# Altium project RC_CAR.PrjPCB
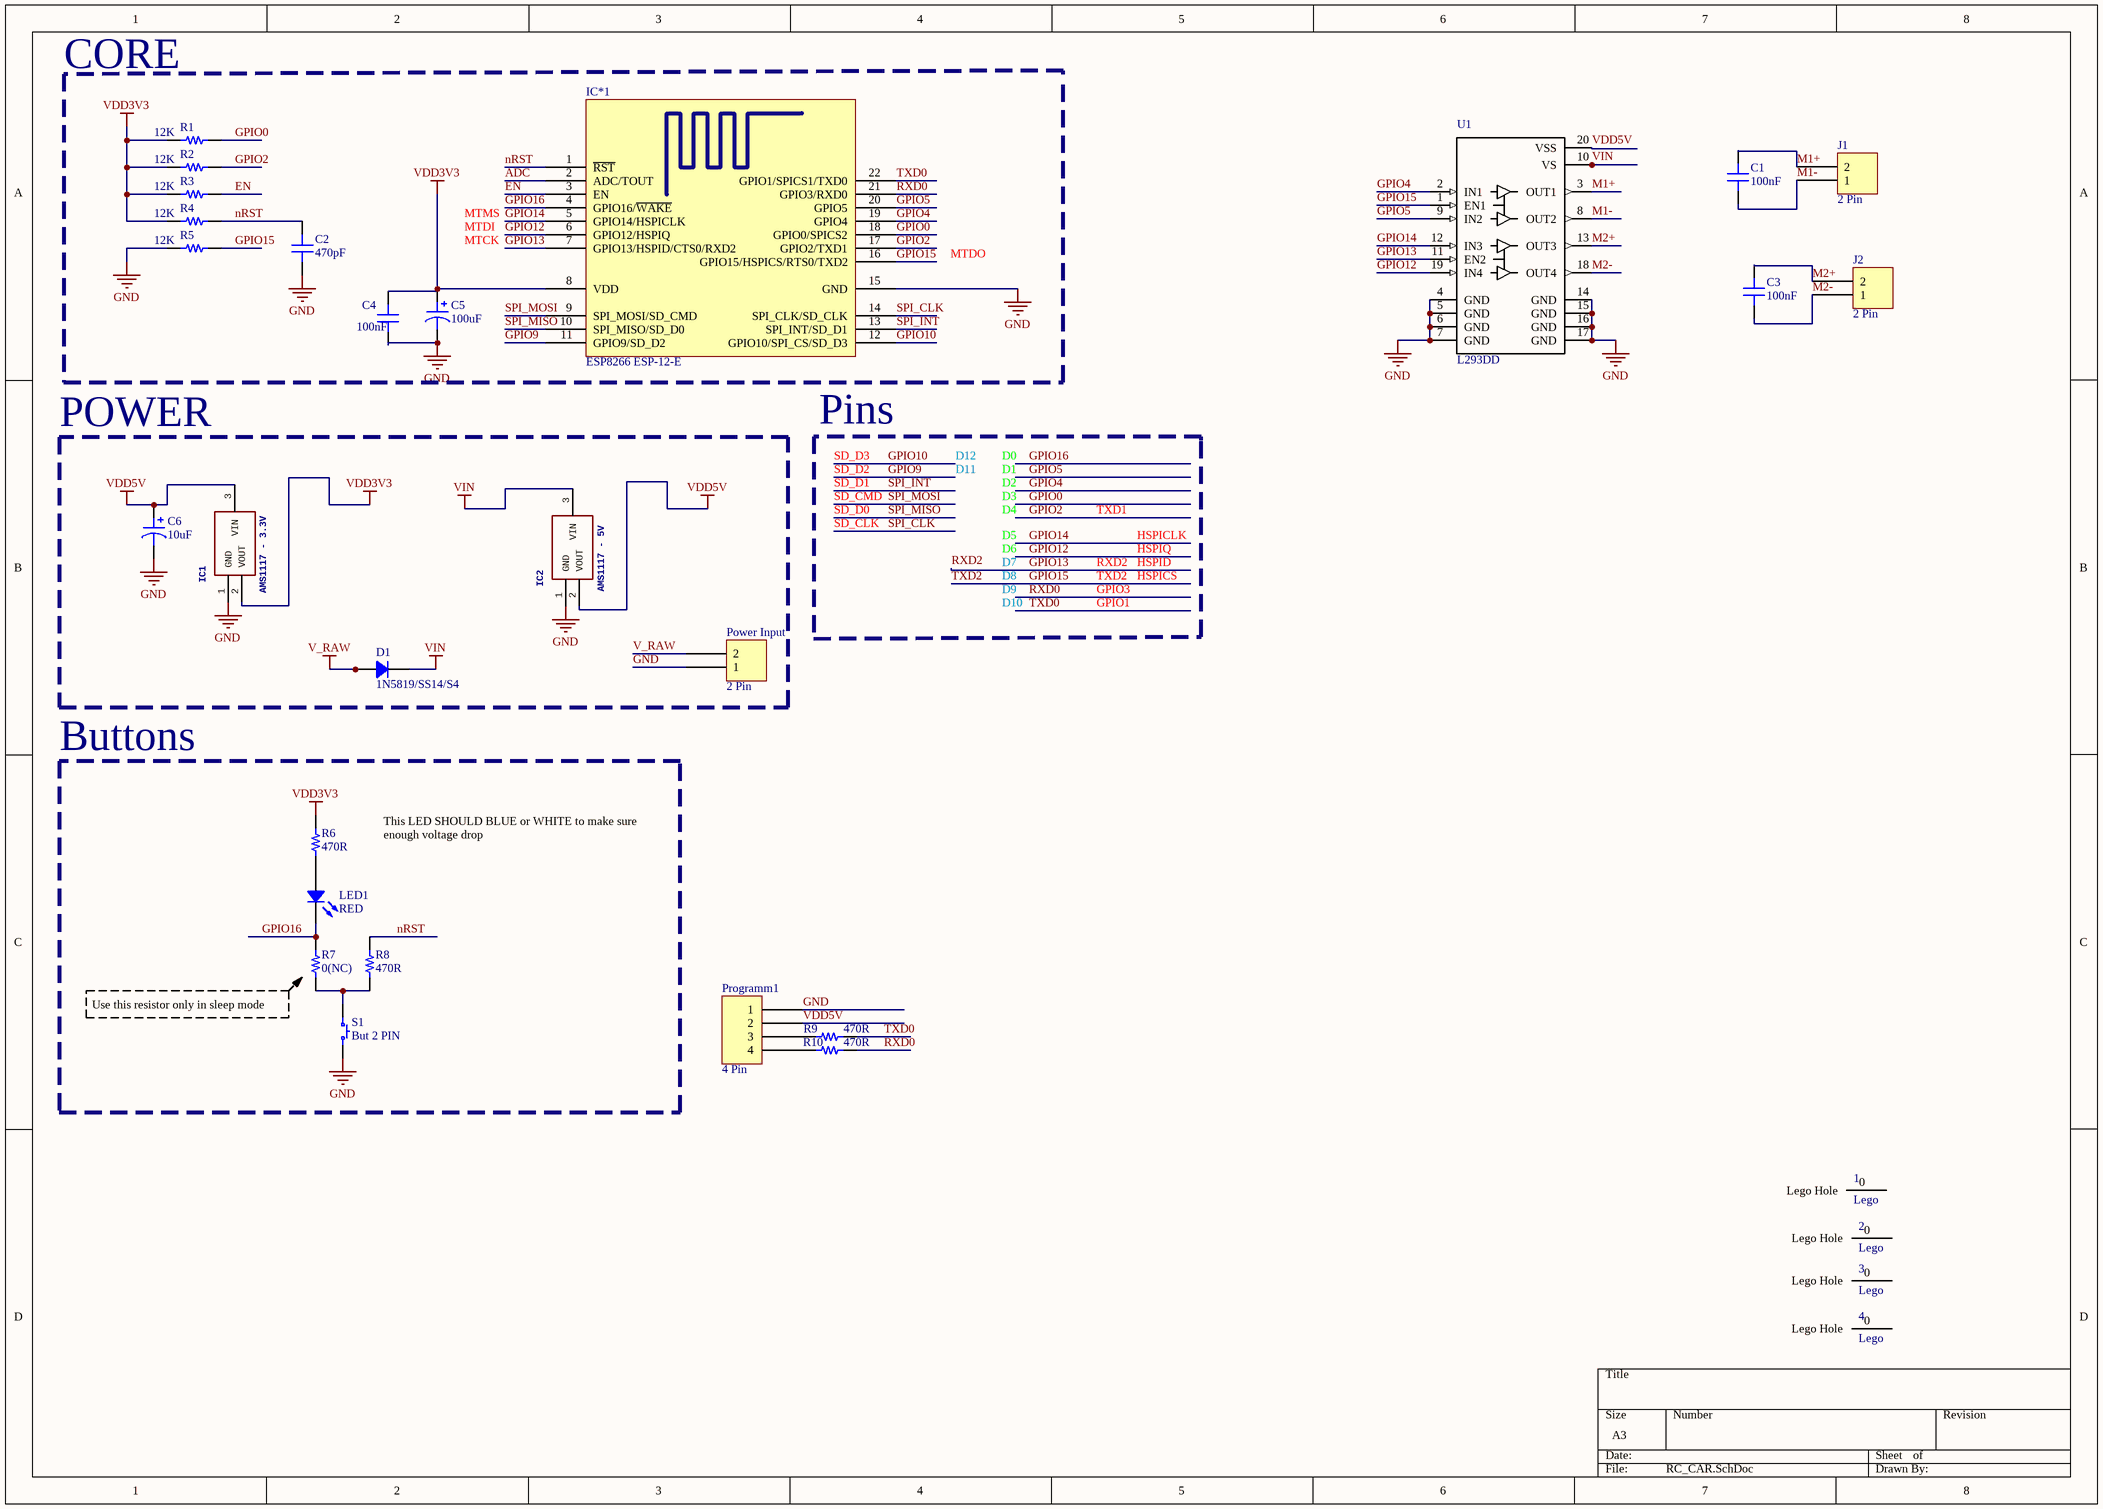
[diagram p0: RC_CAR.SchDoc]
1 sheet, 31 parts. Net scope: global (net labels, ports and power ports of the same name join across sheets).
Board file: RC_CAR.PcbDoc

## Sheet RC_CAR.SchDoc
size A3

### Parts
1  Lego  [Lego Hole]
2  Lego  [Lego Hole]
3  Lego  [Lego Hole]
4  Lego  [Lego Hole]
C1  100nF  [CAP 0805/2012]
C2  470pF  [CAP 0805/2012]
C3  100nF  [CAP 0805/2012]
C4  100nF  [CAP 0805/2012]
C5  100uF  [CAP ALUM 5MM]
C6  10uF  [CAP ALUM 5MM]
D1  1N5819/SS14/S4  [DO214AC SMA]
IC1  AMS1117 - 3.3V  [AMS1117]
IC2  AMS1117 - 5V  [AMS1117]
IC*1  ESP8266 ESP-12-E  [ESP8266 ESP-12-E]
J1  2 Pin  [Socket_Blue_2]
J2  2 Pin  [Socket_Blue_2]
LED1  RED  [LED 0805/2012 YELLOW]
Power_Input  2 Pin  [Socket_Blue_2]
Programm1  4 Pin  [SAMTEC SSW-104-03-T-S]
R1  12K  [RES 0805/2012]
R2  12K  [RES 0805/2012]
R3  12K  [RES 0805/2012]
R4  12K  [RES 0805/2012]
R5  12K  [RES 0805/2012]
R6  470R  [RES 0805/2012]
R7  0(NC)  [RES 0805/2012]
R8  470R  [RES 0805/2012]
R9  470R  [RES 0805/2012]
R10  470R  [RES 0805/2012]
S1  But 2 PIN  [TE FSMSMTR]
U1  L293DD  [SOIC127P1030-20N]

### Blocks framed on the sheet
POWER: C6 D1 IC1 IC2 Power_Input
Buttons: LED1 R6-R8 S1

### Nets
GND: C2.1 C4.1 C5.2 C6.2 IC1.1(GND) IC2.1(GND) IC*1.15(GND) Power_Input.1 Programm1.1 R5.2 S1.2 U1.4(GND) U1.5(GND) U1.6(GND) U1.7(GND) U1.14(GND) U1.15(GND) U1.16(GND) U1.17(GND)
V_RAW: D1.1 Power_Input.2
VDD3V3: C4.2 C5.1 IC1.2(VOUT) IC*1.8(VDD) R1.2 R2.2 R3.2 R4.2 R6.1
VDD5V: C6.1 IC1.3(VIN) IC2.2(VOUT) Programm1.2 U1.20(VSS)
VIN: D1.2 IC2.3(VIN) U1.10(VS)
ADC: IC*1.2(ADC/TOUT)
EN: IC*1.3(EN) R3.1
GPIO0: IC*1.18(GPIO0/SPICS2) R1.1
GPIO2: IC*1.17(GPIO2/TXD1) R2.1
GPIO4: IC*1.19(GPIO4) U1.2(IN1)
GPIO5: IC*1.20(GPIO5) U1.9(IN2)
GPIO9: IC*1.11(GPIO9/SD_D2)
GPIO10: IC*1.12(GPIO10/SPI_CS/SD_D3)
GPIO12: IC*1.6(GPIO12/HSPIQ) U1.19(IN4)
GPIO13: IC*1.7(GPIO13/HSPID/CTS0/RXD2) U1.11(EN2)  [also labelled RXD2]
GPIO14: IC*1.5(GPIO14/HSPICLK) U1.12(IN3)
GPIO15: IC*1.16(GPIO15/HSPICS/RTS0/TXD2) R5.1 U1.1(EN1)  [also labelled TXD2]
GPIO16: IC*1.4(GPIO16/~{WAKE}) LED1.2 R7.1
M1+: C1.2 J1.2 U1.3(OUT1)
M1-: C1.1 J1.1 U1.8(OUT2)
M2+: C3.2 J2.2 U1.13(OUT3)
M2-: C3.1 J2.1 U1.18(OUT4)
nRST: C2.2 IC*1.1(~{RST}) R4.1 R8.1
RXD0: IC*1.21(GPIO3/RXD0) R10.2
SPI_CLK: IC*1.14(SPI_CLK/SD_CLK)
SPI_INT: IC*1.13(SPI_INT/SD_D1)
SPI_MISO: IC*1.10(SPI_MISO/SD_D0)
SPI_MOSI: IC*1.9(SPI_MOSI/SD_CMD)
TXD0: IC*1.22(GPIO1/SPICS1/TXD0) R9.2
NetLED1_1: LED1.1 R6.2
NetProgramm1_3: Programm1.3 R9.1
NetProgramm1_4: Programm1.4 R10.1
NetR7_2: R7.2 R8.2 S1.1

Not connected (* = marked no-connect by the designer): 1 0(Lego_Hole); 2 0(Lego_Hole); 3 0(Lego_Hole); 4 0(Lego_Hole)

### Notes on the sheet
- CORE
- MTCK
- MTDI
- MTMS
- MTDO
- (near IC*1) Pins
- SD_D0
- SD_CMD
- SD_D1
- SD_D3
- SD_D2
- D12
- D11
- D0
- D1
- D2
- D3
- D4
- TXD1
- SD_CLK
- D5
- D6
- D7
- D8
- TXD2
- RXD2
- HSPICLK
- HSPIQ
- HSPID
- HSPICS
- D9
- D10
- GPIO3
- GPIO1
- This LED SHOULD BLUE or WHITE to make sure enough voltage drop
- Use this resistor only in sleep mode

### Library data of the parts
C1-C4 = Capacitor: SMT Capacitor; Value: 0.1uF
C5 = Polarised Capacitor: SMT Polarised Capacitor; Value: 10uF
C6 = Polarised Capacitor: SMT Polarised Capacitor; Value: 10uF
D1 = Diode: Rectifier Diode
IC1 = AMS1117: Manufacturer_Name: Advanced Monolithic Systems; GateName_1: G$1; SymbolName_1: AMS1117-3.3V; LibraryName: ams1117-3.3v; DeviceSetName: AMS1117-3.3V; Package: SOT229P700X180-4N; Supplier_Name: RS; Manufacturer_Part_Number: ams1117-3.3v; Height: 1.8mm
IC2 = AMS1117: Manufacturer_Name: Advanced Monolithic Systems; GateName_1: G$1; SymbolName_1: AMS1117-3.3V; LibraryName: ams1117-3.3v; DeviceSetName: AMS1117-3.3V; Package: SOT229P700X180-4N; Supplier_Name: RS; Manufacturer_Part_Number: ams1117-3.3v; Height: 1.8mm
LED1 = LED: Chip LED; Value: Green
R1-R10 = Resistor: SMT Resistor; Value: 1K
U1 = L293DD: IC MOTOR DRIVER PAR 20-SOIC; MF: STMicroelectronics; Availability: Good; Price: 3.02 USD; Package: SOIC-20 STMicroelectronics; MP: L293DD; Value: *